# EAGLE design Jar of Fireflies (EAGLE 9.2.2)
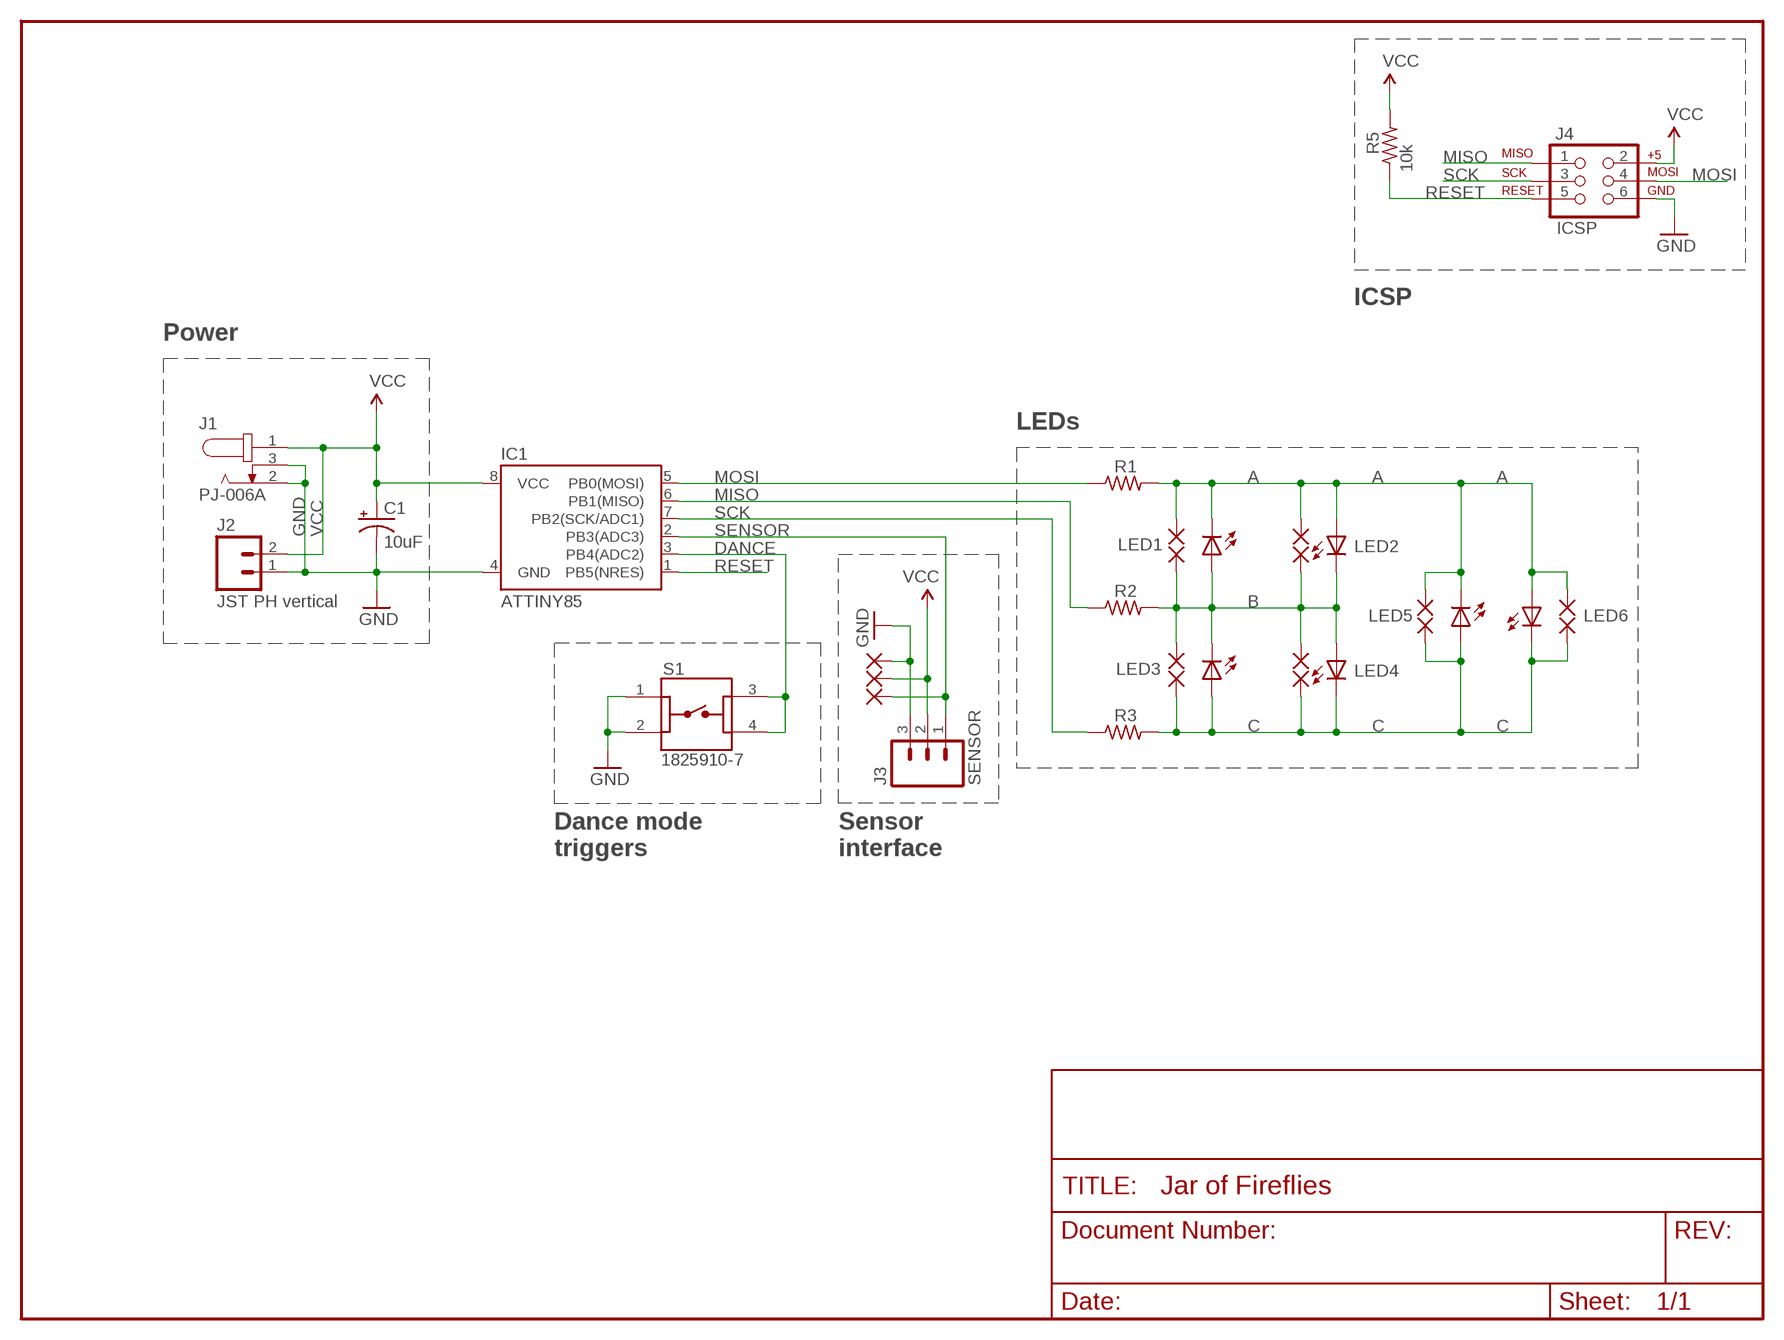
[diagram p0: schematic, sheet 1]

## Parts
C1  10uF  CAP_POLPTH2  [CPOL-RADIAL-10UF-25V]
IC1  ATTINY85  ATTINY45DIP8  [DIP08]
J1  PJ-006A  [CUI_PJ-006A]
J2  JST PH vertical  M02JST-PTH-VERT  [JST-2-PTH-VERT]
J3  SENSOR  M03PTH  [1X03]
J4  ICSP  AVR_SPI_PRG_62X3_LOCK  [2X3_LOCK]
LED1  Amber  LED5MM  [LED5MM]
LED2  Amber  LED5MM  [LED5MM]
LED3  Amber  LED5MM  [LED5MM]
LED4  Amber  LED5MM  [LED5MM]
LED5  Amber  LED5MM  [LED5MM]
LED6  Amber  LED5MM  [LED5MM]
PAD1  SMD2  [SMD1,27-2,54]
PAD2  SMD2  [SMD1,27-2,54]
PAD3  SMD2  [SMD1,27-2,54]
PAD4  SMD2  [SMD1,27-2,54]
PAD5  SMD2  [SMD1,27-2,54]
PAD6  SMD2  [SMD1,27-2,54]
PAD7  SMD2  [SMD1,27-2,54]
PAD8  SMD2  [SMD1,27-2,54]
PAD9  SMD2  [SMD1,27-2,54]
PAD10  SMD2  [SMD1,27-2,54]
PAD11  SMD2  [SMD1,27-2,54]
PAD12  SMD2  [SMD1,27-2,54]
PAD13  WIREPADSMD1,27-254  [SMD1,27-2,54]
PAD14  WIREPADSMD1,27-254  [SMD1,27-2,54]
PAD15  WIREPADSMD1,27-254  [SMD1,27-2,54]
R1  150  R-US_0207/2V  [0207/2V]
R2  150  R-US_0207/2V  [0207/2V]
R3  150  R-US_0207/2V  [0207/2V]
R5  10k  R-US_0207/2V  [0207/2V]
S1  1825910-7  [SW_1825910-7]

## Nets
A: LED1.K(C) LED2.A LED5.K(C) LED6.A PAD1.1(P) PAD5.1(P) PAD9.1(P) PAD11.1(P) R1.2
B: LED1.A LED2.K(C) LED3.K(C) LED4.A PAD2.1(P) PAD3.1(P) PAD6.1(P) PAD7.1(P) R2.2
C: LED3.A LED4.K(C) LED5.A LED6.K(C) PAD4.1(P) PAD8.1(P) PAD10.1(P) PAD12.1(P) R3.2
DANCE: IC1.3(PB4(ADC2)) S1.3 S1.4
GND: C1.2(-) IC1.4(GND) J1.2 J1.3 J2.1 J3.3 J4.6 PAD13.1(P) S1.1 S1.2
MISO: IC1.6(PB1(MISO)) J4.1 R2.1
MOSI: IC1.5(PB0(MOSI)) J4.4 R1.1
RESET: IC1.1(PB5(NRES)) J4.5 R5.1
SCK: IC1.7(PB2(SCK/ADC1)) J4.3 R3.1
SENSOR: IC1.2(PB3(ADC3)) J3.1 PAD15.1(P)
VCC: C1.1(+) IC1.8(VCC) J1.1 J2.2 J3.2 J4.2 PAD14.1(P) R5.2

## Notes on the sheet
- ICSP
- Power
- LEDs
- Dance mode
  triggers
- Sensor
  interface

## Library data of the parts
C1 = SparkFun-Capacitors:CAP_POL: Capacitor Polarized These are standard SMD and PTH capacitors. Normally 10uF, 47uF, and 100uF in electrolytic and tantalum varieties. Always verify the external diameter of the through hole cap, it varies with capacity, voltage, and manufacturer. The EIA devices should be standard.
IC1 = SparkFun:ATTINY45: Atmel ATTiny45
J1 = PJ-006A:PJ-006A: 2.0 mm Center Pin, 2.0 A, Vertical, Through Hole, Dc Power Jack Connector; MANUFACTURER: CUI INC; STANDARD: Manufacturer recommendations
J2 = SparkFun-Connectors:M02: Standard 2-pin 0.1" header. Use with - straight break away headers ( PRT-00116) - right angle break away headers (PRT-00553) - swiss pins (PRT-00743) - machine pins (PRT-00117) - female headers (PRT-00115) Molex polarized connector foot print use with: PRT-08233 with associated crimp pins and housings. 2.54_SCREWTERM for use with PRT-10571. 3.5mm Screw Terminal footprints for PRT-08084 5mm Screw Terminal footprints for use with PRT-08432
J3 = SparkFun-Connectors:M03: Header 3 Standard 3-pin 0.1" header. Use with straight break away headers (SKU : PRT-00116), right angle break away headers (PRT-00553), swiss pins (PRT-00743), machine pins (PRT-00117), and female headers (PRT-00115). Molex polarized connector foot print use with SKU : PRT-08232 with associated crimp pins and housings.
J4 = SparkFun-Connectors:AVR_SPI_PRG_6: AVR ISP 6 Pin This is the reduced ISP connector for AVR programming. Common on Arduino. This footprint will take up less PCB space and can be used with a 10-pin to 6-pin adapter such as SKU: BOB-08508 **Special note about "TEST_POINT" package. The stop mask is on the top side, so if you want your programming test points to be on the bottom of your board, make sure to place this package on the bottom side of the board. This also ensure that the orientation to program from the bottom side will be correct.
LED1-LED6 = SparkFun:LED: LEDs Standard schematic elements and footprints for 5mm, 3mm, 1206, and 0603 sized LEDs. 5mm - Spark Fun Electronics SKU : COM-00529 (and others)
PAD1-PAD12 = wirepad:SMD2: SMD PAD
PAD13-PAD15 = wirepad:WIREPAD: Wire PAD connect wire on PCB
R1-R3 R5 = resistor:R-US_: RESISTOR, American symbol
S1 = 1825910-7:1825910-7: Switch Tactile OFF (ON) SPST Round Button PC Pins 0.05A 24VDC 100000Cycles 2.55N Thru-Hole Loose; COMMENT: 1825910-7; CONFIGURATION_POLE-THROW: Single Pole - Single Throw; CONTACT_CURRENT_RATING: 50 mA; DESCRIPTION: FSM4JAH=6MM TACT SWITCH, HIGH TEMP; DIGI-KEY_PART_NUMBER: 450-1804-ND; DIGI-KEY_PURCHASE_URL: https://www.digikey.com/product-detail/en/te-connectivity-alcoswitch-switches/1825910-7/450-1804-ND/1731414?utm_source=snapeda&utm_medium=aggregator&utm_campaign=symbol; EU_ROHS_COMPLIANCE: Compliant; LINK: http://www.te.com/usa-en/product-1825910-7.html; MF: TE Connectivity; MP: 1825910-7; PACKAGE: None

## Board
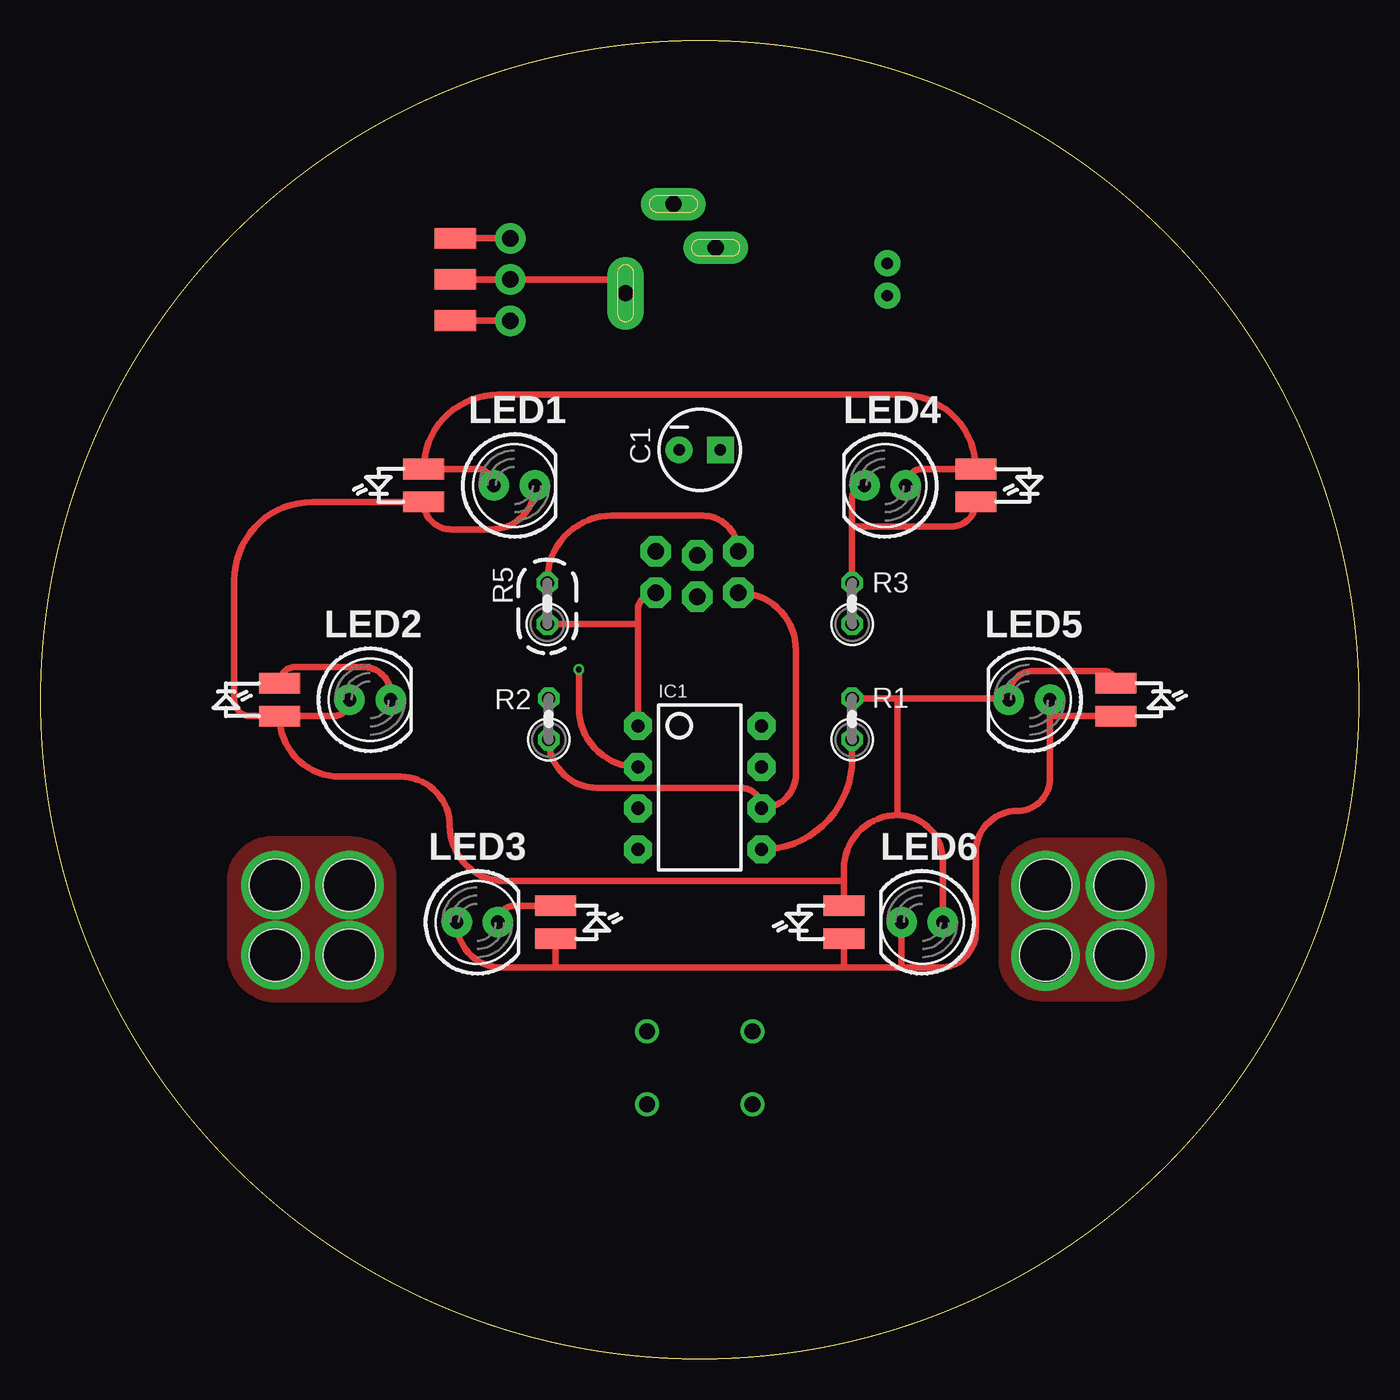
[diagram p1: board, top side]
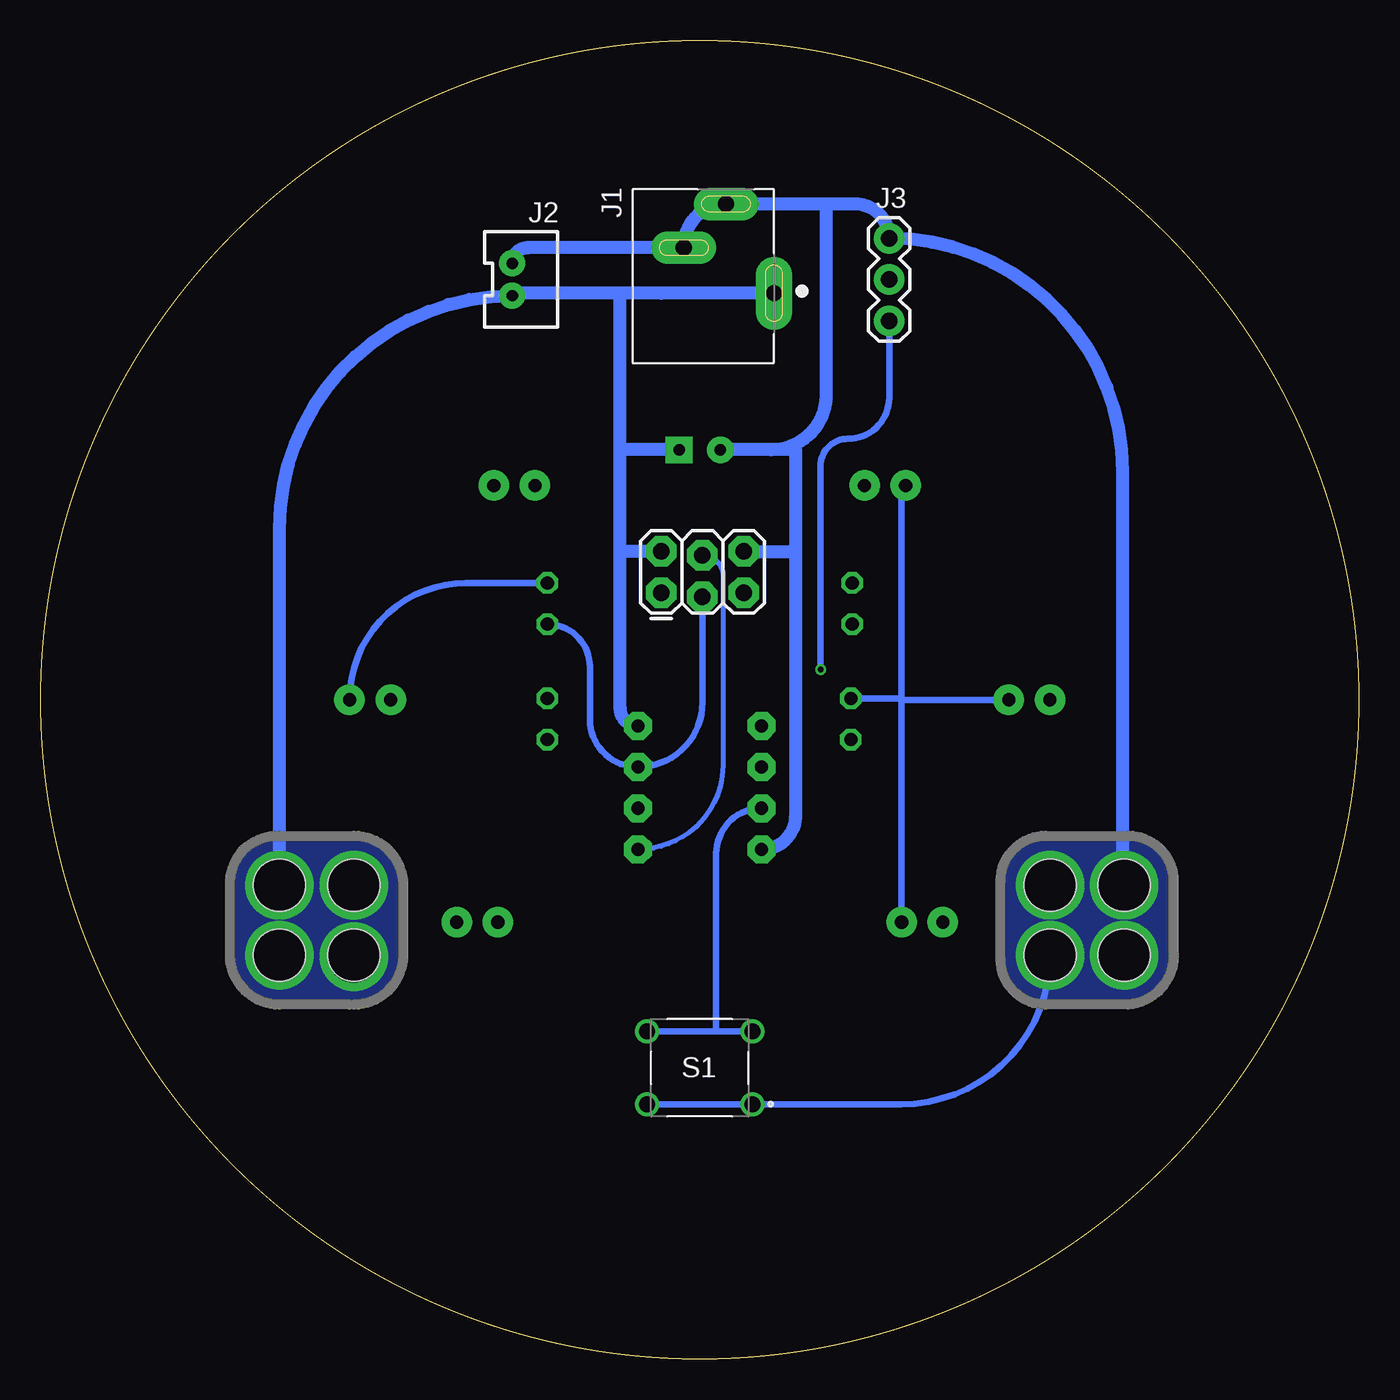
[diagram p2: board, bottom side, seen from below]

Size 81.28 x 81.28 mm. Coordinates in mm from the lower left corner, seen from the top.
Outline: circle at 40.64,40.64 radius 40.64
Copper layers (1*16): Top 0.035mm / dielectric 1.5mm / Bottom 0.035mm
Design rules "SeeedStudio_2layer_DRU_no_angle_20140221": minimum track width 6mil, minimum drill 12mil, track to track 6mil, track to pad 6mil, pad to pad 6mil, via to via 6mil, smd to smd 0mil, copper to edge 10mil, drill to drill 10mil, minimum pad ring 10mil, minimum via ring 6mil, stop-mask expansion 2mil, vias tented up to drill 100mil, thermal gap 10mil
Holes 3.2 mm at 19.05,24.89 19.05,29.21 61.98,29.21 61.98,24.89 14.48,29.21 14.48,24.89 66.55,29.21 66.55,24.89

### Footprints (pad centres in the part's own frame; a part is rotated, then mirrored left to right if it is on the bottom)
CPOL-RADIAL-10UF-25V = drill 0.7 pad 1.651 square: 1 1.27,0 | drill 0.7 pad 1.651: 2 -1.27,0
DIP08 = drill 0.813 pad 1.727 octagon: 1 -3.81,-3.81; 2 -1.27,-3.81; 3 1.27,-3.81; 4 3.81,-3.81; 5 3.81,3.81; 6 1.27,3.81; 7 -1.27,3.81; 8 -3.81,3.81
CUI_PJ-006A = drill 1 pad 2.25 long: 1 0,0 | drill 1 pad 2 long: 2 -5.5,-2.95; 3 -2.8,-5.55
JST-2-PTH-VERT = drill 0.7 pad 1.6: 1 -1,-0.55; 2 1,-0.55
1X03 = drill 1.016 pad 1.88: 1 0,0; 2 2.54,0; 3 5.08,0
2X3_LOCK = drill 1.016 pad 1.88 octagon: 1 0,0; 2 0,2.54; 3 2.54,-0.254; 4 2.54,2.286; 5 5.08,0; 6 5.08,2.54
LED5MM = drill 0.813 pad 1.88: A -1.27,0; K 1.27,0
SMD1,27-2,54 = smd 1.27 x 2.54: 1 0,0
0207/2V = drill 0.813 octagon: 1 -1.27,0; 2 1.27,0
SW_1825910-7 = drill 0.99: 1 -3.25,2.25; 2 3.25,2.25; 3 -3.25,-2.25; 4 3.25,-2.25

### Placement (x,y rotation side)
C1  40.64,56.05 0 top
IC1  40.64,35.22 270 top
J1  36.07,65.7 270 bottom
J2  51.65,66.55 270 bottom
J3  28.96,64.01 90 bottom
J4  43.01,47.25 0 bottom
LED1  29.21,53.85 0 top
LED2  20.32,40.64 0 top
LED3  26.92,26.92 0 top
LED4  52.07,53.85 180 top
LED5  60.96,40.64 180 top
LED6  54.36,26.92 180 top
PAD1  23.62,52.83 270 top
PAD2  23.62,54.86 270 top
PAD3  31.75,27.94 90 top
PAD4  31.75,25.91 90 top
PAD5  14.73,39.62 90 top
PAD6  14.73,41.66 90 top
PAD7  57.66,54.86 90 top
PAD8  57.66,52.83 90 top
PAD9  66.29,41.66 90 top
PAD10  66.29,39.62 90 top
PAD11  49.53,27.94 90 top
PAD12  49.53,25.91 90 top
PAD13  25.57,69.09 90 top
PAD14  25.57,66.55 90 top
PAD15  25.57,64.01 90 top
R1  50.04,39.45 90 top
R2  31.33,39.45 90 top
R3  50.04,46.57 90 top
R5  31.24,46.57 90 top
S1  40.64,17.95 180 bottom

### Tracks (layer width: path | path; a pad name or v marks a point on that pad's centre or on a via)
A
  Top 0.406: PAD5.1 12.95,39.62 arc-90 11.94,40.64 11.94,48.01 arc-90 16.76,52.83 PAD1.1 arc90 25.31,51.14 27.77,51.14 arc90 LED1.K | LED2.A arc-90 18.03,39.62 PAD5.1 | PAD11.1 49.53,29.46 | 49.53,29.46 49.53,30.23 arc-90 52.83,33.53 | 52.83,33.53 arc-90 55.63,30.73 LED6.A | PAD5.1 arc90 18.46,35.9 22.18,35.9 arc-90 25.23,32.85 arc90 28.62,29.46 49.53,29.46 | R1.2 52.84,40.73 | 52.84,40.73 59.6,40.73 arc-90 LED5.K 59.69,40.89 arc-90 61.21,42.42 65.53,42.42 arc-90 PAD9.1 | 52.83,33.53 52.83,40.72 arc-90 52.84,40.73
B
  Top 0.406: PAD3.1 29.21,27.94 arc90 LED3.K | PAD6.1 arc-90 15.75,42.67 20.07,42.67 arc-90 LED2.K | LED4.A arc-90 54.36,54.86 PAD7.1 arc90 53.08,59.44 28.2,59.44 arc90 PAD2.1 26.92,54.86 arc-90 LED1.A
  Bottom 0.406: LED3.K 28.19,40.64 | 28.19,40.64 28.19,40.73 | 28.19,40.73 28.19,53.59 LED1.A | LED2.K 28.19,40.64 | R2.2 28.19,40.73
C
  Top 0.406: 49.53,24.13 31.75,24.13 | 53.09,24.13 55.46,24.13 arc90 57.66,26.33 57.66,31.24 arc-90 60.2,33.78 arc90 62.23,35.81 62.23,39.63 | 53.09,24.13 49.53,24.13 | PAD4.1 31.75,24.13 | PAD8.1 arc-90 56.13,51.31 52.07,51.31 arc90 52.07,51.31 50.04,51.31 | PAD12.1 49.53,24.13 | LED6.K 53.09,24.13 | 62.23,39.63 LED5.A | LED4.K arc90 50.04,53.09 50.04,51.31 | 50.04,51.31 R3.2 | PAD10.1 62.23,39.62 arc-90 62.23,39.63 | 31.75,24.13 28.45,24.13 arc-90 LED3.A
  Bottom 0.406: R3.2 55.03,47.84 arc-90 LED5.A
DANCE
  Bottom 0.406: S1.3 39.63,20.2 | 39.63,20.2 S1.4 | IC1.3 arc-90 39.63,31.16 39.63,20.2
GND  (via drill 3.2)
  Top 0.406: PAD13.1 J3.3 | J3.3
  Bottom 0.406: v19.05,24.89 arc90 28.24,15.7 S1.1 S1.2
  Bottom 0.813: 32.85,71.2 32.85,59.44 arc90 36.24,56.05 | v14.48,29.21 14.56,29.38 14.56,54.7 arc-90 J3.3 arc-90 31.07,71.2 32.85,71.2 | 32.85,71.2 J1.2 arc-90 41.62,68.61 J1.3 51.25,68.5 arc-90 J2.1 | 36.24,56.05 C1.2 | IC1.4 arc-90 34.72,33.53 34.72,49.79 | 36.24,56.05 34.72,56.05 34.72,49.79 | J4.6 34.72,49.79
  other vias: 19.05,29.21 14.48,24.89
  pour Top: 19.3,22.1 19.56,22.1 arc90 21.84,24.38 21.84,29.63 arc73 20.15,31.92 arc13 19.22,32.09 14.22,32.09 14.22,32.09 arc90 11.6,29.46 11.6,25.06 arc90 14.56,22.1 19.22,22.1
  pour Bottom: 19.3,22.1 19.56,22.1 arc90 21.84,24.38 21.84,29.63 arc73 20.15,31.92 arc13 19.22,32.09 14.22,32.09 14.22,32.09 arc90 11.6,29.46 11.6,25.06 arc90 14.56,22.1 19.22,22.1
MISO
  Top 0.406: R2.1 arc90 34.31,35.2 43.2,35.2 arc-90 IC1.6 arc90 46.57,36.07 46.57,43.69 arc90 J4.1
MOSI
  Top 0.406: R1.1 50.04,37 arc-90 IC1.5
  Bottom 0.305: J4.4 arc90 39.2,48.26 39.2,36.66 arc90 IC1.5
RESET
  Top 0.406: J4.5 arc90 36.83,46.14 36.83,45.21 | 36.83,45.21 IC1.1 | R5.1 36.74,45.3 arc-90 36.83,45.21
SCK
  Bottom 0.406: J4.3 40.47,40.47 arc90 IC1.7 arc90 47.42,39.46 47.42,42.68 arc-90 R3.1
SENSOR  (via drill 0.35)
  Top 0.406: v33.19,42.51 33.19,40.13 arc90 IC1.2 | PAD15.1 J3.1 | J3.1
  Bottom 0.406: J3.1 28.96,59.27 arc90 31.5,56.73 arc-90 33.19,55.04 v33.19,42.51
VCC  (via drill 3.2)
  Top 0.406: J3.2 35.22,66.55 arc-90 J1.1 | R5.2 31.24,48.01 arc-90 35.22,51.99 40.81,51.99 arc-90 J4.2 | PAD14.1 J3.2 | J3.2
  Bottom 0.813: v66.55,29.21 66.55,51.2 arc90 J2.2 arc90 52.05,65.7 45.55,65.7 | IC1.8 arc90 45.55,40.13 45.55,49.79 | J1.1 43.01,65.7 | 43.01,65.7 45.55,65.7 | 43.01,65.7 | 43.01,65.7 arc-90 43.01,65.7 | J4.2 45.55,49.79 | 45.55,49.79 45.55,56.05 | 45.55,56.05 45.55,65.7 | C1.1 45.55,56.05 arc90 45.55,56.05
  other vias: 61.98,29.21 66.55,24.89 61.98,24.81
  pour Top: 66.63,22.18 arc90 69.34,24.89 69.34,29.46 arc90 66.8,32 62.05,32 61.89,32 arc90 59.18,29.29 59.18,24.64 arc90 61.63,22.18
  pour Bottom: 66.63,22.18 arc90 69.34,24.89 69.34,29.46 arc90 66.8,32 62.05,32 61.89,32 arc90 59.18,29.29 59.18,24.64 arc90 61.63,22.18

### Text on the board
tValues: 10uF
bValues: - | - | + | + | S | - | +
bDocu: - | + | SIGNAL | LED1 | LED4 | LED2 | LED5 | - | + | LED3 | LED6